# EAGLE schematic schematic_BAR (EAGLE 6.5.0)
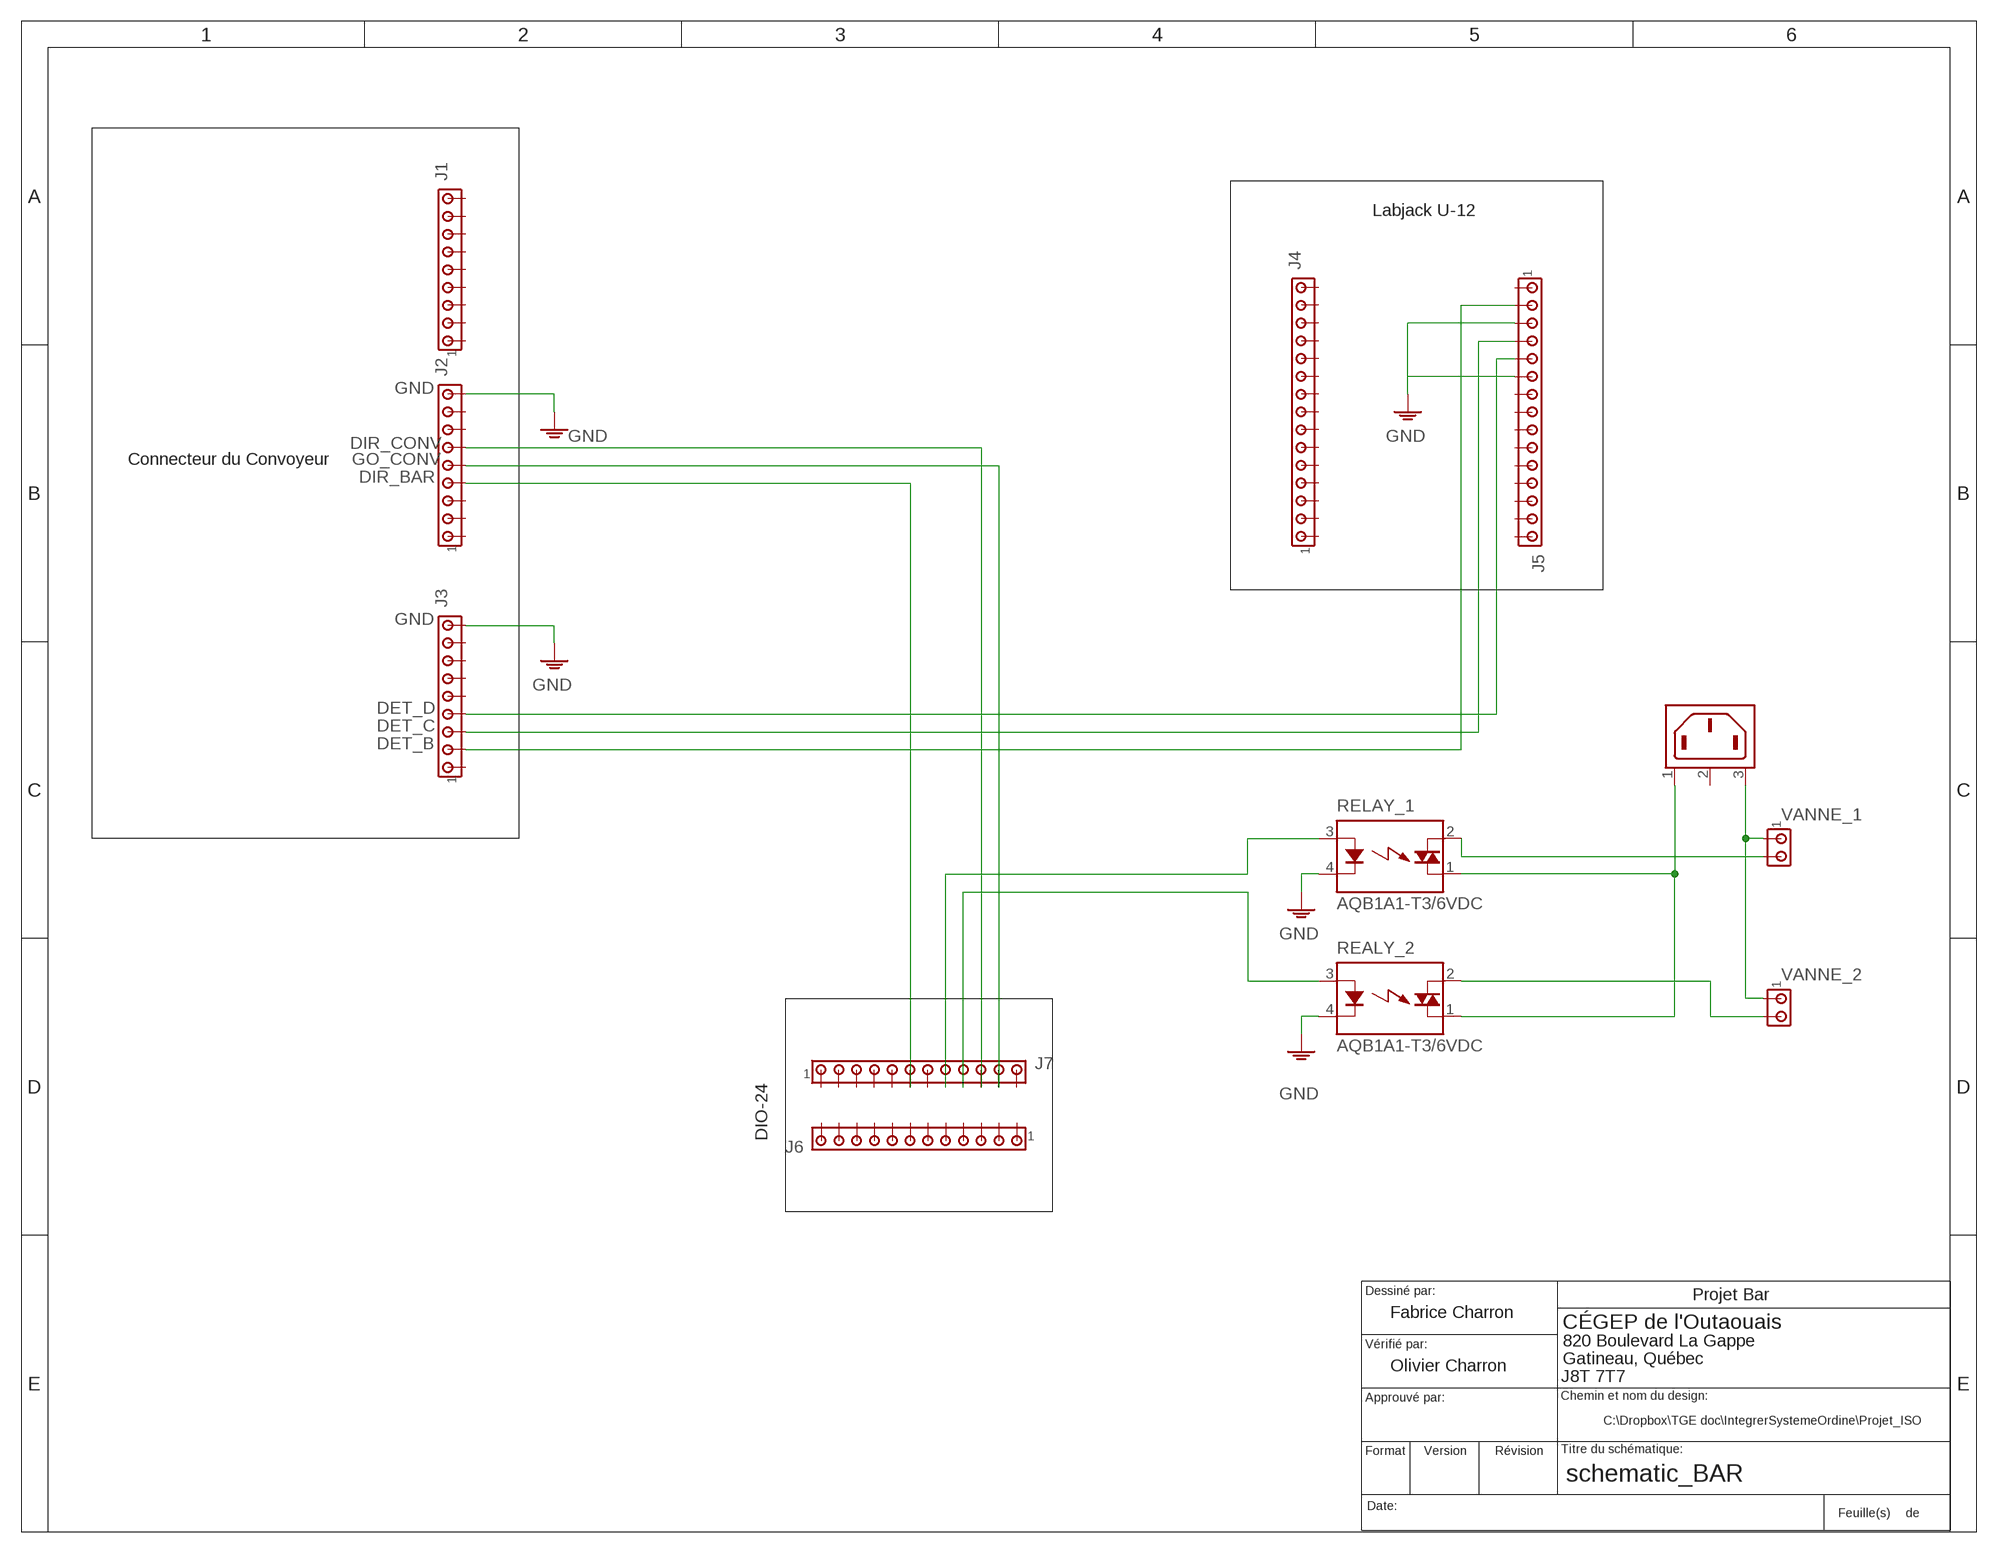
[diagram p0: schematic, sheet 1]

## Parts
J1  MTA09-100  [10X09MTA]
J2  MTA09-100  [10X09MTA]
J3  MTA09-100  [10X09MTA]
J4  MTA15-156  [1X15MTA]
J5  MTA15-156  [1X15MTA]
J6  MTA12-156  [1X12MTA]
J7  MTA12-156  [1X12MTA]
REALY_2  AQB1A1-T3/6VDC  [AQ-B]
RELAY_1  AQB1A1-T3/6VDC  [AQ-B]
SOURCE_120V  6ESRM-P  [6ESRM-P]
VANNE_1  MTA02-100  [10X02MTA]
VANNE_2  MTA02-100  [10X02MTA]

## Nets
DET_B: J3.2 J5.2
DET_C: J3.3 J5.4
DET_D: J3.4 J5.5
DIR_BAR: J2.4 J7.6
DIR_CONV: J2.6 J7.10
GND: J2.9 J3.9 J5.3 J5.6 REALY_2.4(K) RELAY_1.4(K)
GO_CONV: J2.5 J7.11
N$1: J7.9 REALY_2.3(A)
N$2: J7.8 RELAY_1.3(A)
N$3: SOURCE_120V.3(AC2) VANNE_1.1 VANNE_2.1
N$4: REALY_2.2(DS1) VANNE_2.2
N$5: REALY_2.1(DS2) RELAY_1.1(DS2) SOURCE_120V.1(AC1)
N$7: RELAY_1.2(DS1) VANNE_1.2
Unconnected: J1.1 J1.2 J1.3 J1.4 J1.5 J1.6 J1.7 J1.8 J1.9 J2.1 J2.2 J2.3 J2.7 J2.8 J3.1 J3.5 J3.6 J3.7 J3.8 J4.1 J4.2 J4.3 J4.4 J4.5 J4.6 J4.7 J4.8 J4.9 J4.10 J4.11 J4.12 J4.13 J4.14 J4.15 J5.1 J5.7 J5.8 J5.9 J5.10 J5.11 J5.12 J5.13 J5.14 J5.15 J6.1 J6.2 J6.3 J6.4 J6.5 J6.6 J6.7 J6.8 J6.9 J6.10 J6.11 J6.12 J7.1 J7.2 J7.3 J7.4 J7.5 J7.7 J7.12 SOURCE_120V.2(SH)

## Notes on the sheet
- Labjack U-12
- Connecteur du Convoyeur
- DIO-24
- Projet Bar
- Fabrice Charron
- Olivier Charron
- C:\Dropbox\TGE doc\IntegrerSystemeOrdine\Projet_ISO

## Library data of the parts
J1-J3 = con-amp:MTA09-100: AMP connector
J4 J5 = con-amp:MTA15-156: AMP connector
J6 J7 = con-amp:MTA12-156: AMP connector
REALY_2 RELAY_1 = relay:AQB*: SOLID STATE RELAY NAiS Source: http://www.mew-europe.com/.. en_ds_61604_0000.pdf; OC_FARNELL: unknown; OC_NEWARK: unknown
SOURCE_120V = con-tycoelectronics:6ESRM-P: AC Connector 120/250 VAC Source: http://catalog.tycoelectronics.com .. ENG_DS_1654001_1099_SR_0406.pdf; MF: TYCO ELECTRONICS; MPN: 6ESRM-P; OC_FARNELL: unknown; OC_NEWARK: 87F1821
VANNE_1 VANNE_2 = con-amp:MTA02-100: AMP connector